# Altium schematic sheet 1-Microcontroller.SchDoc
size A4; Author: Fabian Castaño; CompanyName: UdeA; Engineer: Fabian Castaño; Organization: Universidad de Antioquia; Address1: UdeA; Address2: Medellín; Address3: Antioquia; Address4: Colombia 050010; DocumentNumber: 2; Revision: Jaime Osorio; SheetNumber: 2; SheetTotal: 12
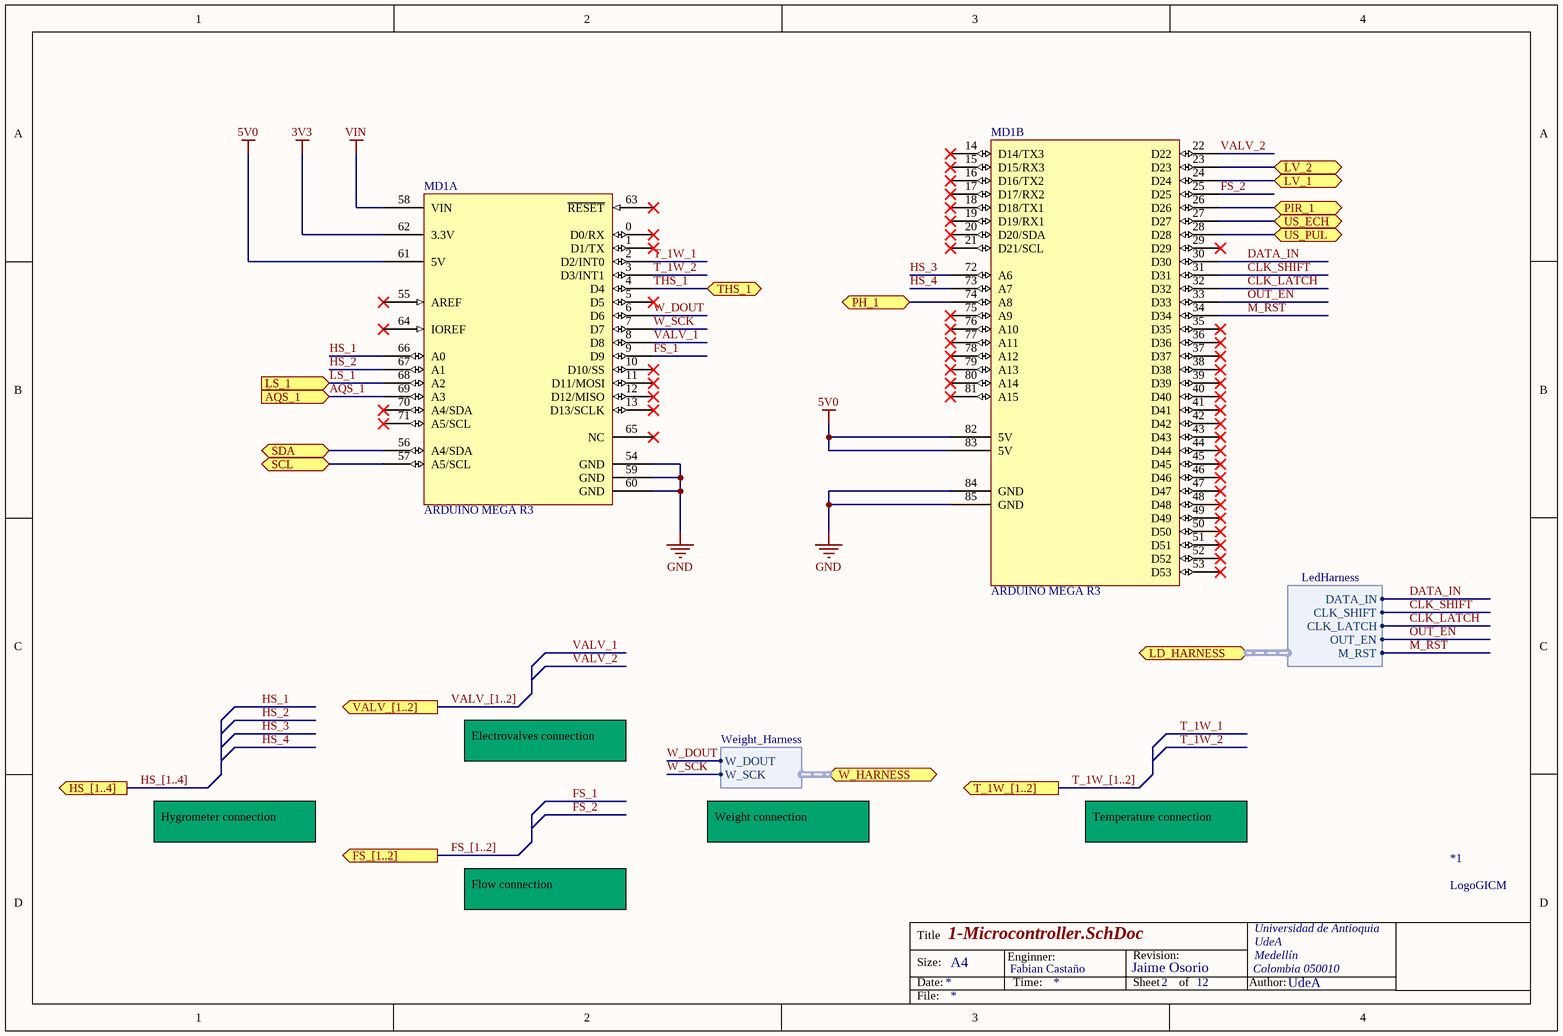
[diagram p0: 1-Microcontroller.SchDoc]

## Parts
*1  LogoGICM  [LOGO]
MD1  ARDUINO MEGA R3  [ArduinoMega]  (parts A,B of 2)

## Ports
AQS_1 (in), FS_[1..2] (out), HS_[1..4] (out), LD_HARNESS (harness LedHarness), LS_1 (in), LV_1, LV_2, PH_1, PIR_1, SCL, SDA, T_1W_[1..2] (out), THS_1, US_ECH, US_PUL, VALV_[1..2] (out), W_HARNESS (harness Weight_Harness)

## Harnesses
Weight_Harness: W_DOUT, W_SCK
LedHarness: DATA_IN, CLK_SHIFT, CLK_LATCH, OUT_EN, M_RST

## Nets
3V3: MD1.62(3.3V)
5V0: MD1.61(5V) MD1.82(5V) MD1.83(5V)
GND: MD1.54(GND) MD1.59(GND) MD1.60(GND) MD1.84(GND) MD1.85(GND)
VIN: MD1.58(VIN)
AQS_1: MD1.69(A3) ; port AQS_1
CLK_LATCH: MD1.32(D32) ; port LD_HARNESS.CLK_LATCH
CLK_SHIFT: MD1.31(D31) ; port LD_HARNESS.CLK_SHIFT
DATA_IN: MD1.30(D30) ; port LD_HARNESS.DATA_IN
FS_1: MD1.9(D9)
FS_2: MD1.25(D25)
HS_1: MD1.66(A0)
HS_2: MD1.67(A1)
HS_3: MD1.72(A6)
HS_4: MD1.73(A7)
LS_1: MD1.68(A2) ; port LS_1
LV_1: MD1.24(D24) ; port LV_1
LV_2: MD1.23(D23) ; port LV_2
M_RST: MD1.34(D34) ; port LD_HARNESS.M_RST
OUT_EN: MD1.33(D33) ; port LD_HARNESS.OUT_EN
PH_1: MD1.74(A8) ; port PH_1
PIR_1: MD1.26(D26) ; port PIR_1
SCL: MD1.57(A5/SCL) ; port SCL
SDA: MD1.56(A4/SDA) ; port SDA
T_1W_1: MD1.2(D2/INT0)
T_1W_2: MD1.3(D3/INT1)
THS_1: MD1.4(D4) ; port THS_1
US_ECH: MD1.27(D27) ; port US_ECH
US_PUL: MD1.28(D28) ; port US_PUL
VALV_1: MD1.8(D8)
VALV_2: MD1.22(D22)
W_DOUT: MD1.6(D6) ; port W_HARNESS.W_DOUT
W_SCK: MD1.7(D7) ; port W_HARNESS.W_SCK

Not connected (* = marked no-connect by the designer): MD1 0(D0/RX)* 1(D1/TX)* 5(D5)* 10(D10/SS)* 11(D11/MOSI)* 12(D12/MISO)* 13(D13/SCLK)* 14(D14/TX3)* 15(D15/RX3)* 16(D16/TX2)* 17(D17/RX2)* 18(D18/TX1)* 19(D19/RX1)* 20(D20/SDA)* 21(D21/SCL)* 29(D29)* 35(D35)* 36(D36)* 37(D37)* 38(D38)* 39(D39)* 40(D40)* 41(D41)* 42(D42)* 43(D43)* 44(D44)* 45(D45)* 46(D46)* 47(D47)* 48(D48)* 49(D49)* 50(D50)* 51(D51)* 52(D52)* 53(D53)* 55(AREF)* 63(~{RESET})* 64(IOREF)* 65(NC)* 70(A4/SDA)* 71(A5/SCL)* 75(A9)* 76(A10)* 77(A11)* 78(A12)* 79(A13)* 80(A14)* 81(A15)*

## Buses and harness runs
bus FS_[1..2] = port FS_[1..2]
bus HS_[1..4] = port HS_[1..4]
bus T_1W_[1..2] = port T_1W_[1..2]
bus VALV_[1..2] = port VALV_[1..2]

## Notes on the sheet
- Electrovalves connection
- Hygrometer connection
- Weight connection
- Temperature connection
- Flow connection
- Title
- Size:
- Date:
- A4
- Enginner:
- Time:
- Revision:
- Sheet
- of
- Author:
- File:

## Library data of the parts
MD1 = Arduino_Mega_R3